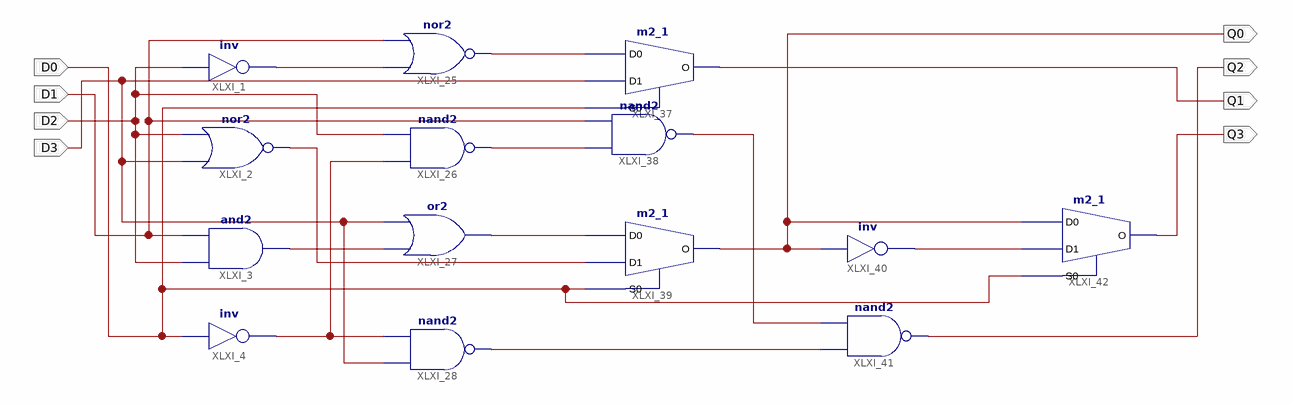
[diagram p0: schematic sheet 1]
// Xilinx ISE schematic dabble.sch (spartan6) as structural Verilog: 14 symbols, 8 ports
module dabble (
  input  D2,
  input  D1,
  input  D0,
  input  D3,
  output Q1,
  output Q3,
  output Q2,
  output Q0
);

  wire XLXN_13, XLXN_14, XLXN_15, XLXN_19, XLXN_23, XLXN_24, XLXN_25, XLXN_26, XLXN_27, XLXN_30;

  not XLXI_1 (XLXN_13, D2);
  nor XLXI_2 (XLXN_25, D3, D2);
  and XLXI_3 (XLXN_15, D2, D1);
  not XLXI_4 (XLXN_14, D0);
  nor XLXI_25 (XLXN_19, XLXN_13, D1);
  nand XLXI_26 (XLXN_23, XLXN_14, D2);
  or XLXI_27 (XLXN_24, XLXN_15, D3);
  nand XLXI_28 (XLXN_26, D3, XLXN_14);
  m2_1 XLXI_37 (.D0(XLXN_19), .D1(D3), .S0(D0), .O(Q1));
  nand XLXI_38 (XLXN_27, XLXN_23, D1);
  m2_1 XLXI_39 (.D0(XLXN_24), .D1(XLXN_25), .S0(D0), .O(Q0));
  not XLXI_40 (XLXN_30, Q0);
  nand XLXI_41 (Q2, XLXN_26, XLXN_27);
  m2_1 XLXI_42 (.D0(Q0), .D1(XLXN_30), .S0(D0), .O(Q3));
endmodule
